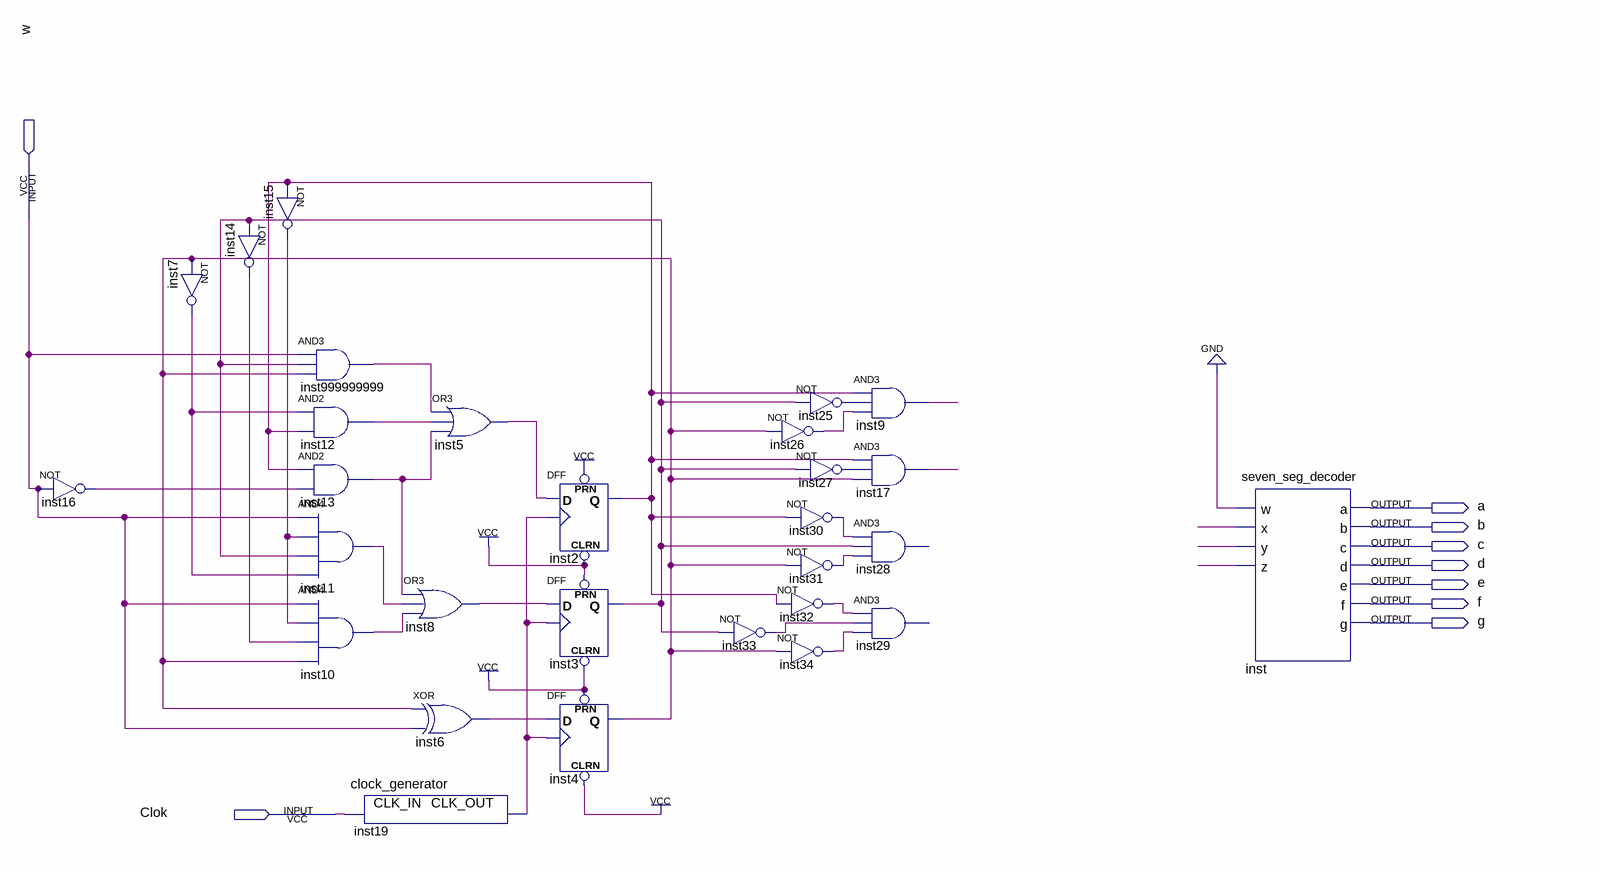
[diagram p0: schematic sheet]
// Quartus schematic lab11step1.bdf as structural Verilog: 29 symbols, 9 pins
module lab11step1 (
  input  w,
  input  Clok,
  output a,
  output b,
  output c,
  output d,
  output e,
  output f,
  output g
);

  wire inst2_q, inst3_q, inst4_q, inst5_out, inst6_out, inst7_out, inst8_out, inst9_out, inst10_out,
       inst11_out, inst12_out, inst13_out, inst14_out, inst15_out, inst16_out, inst17_out, inst19_clk_out,
       inst25_out, inst26_out, inst27_out, inst30_out, inst31_out, inst32_out, inst33_out, inst34_out,
       inst999999999_out, undriven, undriven_2, undriven_3;

  not inst16 (inst16_out, w);
  not inst7 (inst7_out, inst4_q);
  not inst15 (inst15_out, inst2_q);
  not inst14 (inst14_out, inst3_q);
  and inst999999999 (inst999999999_out, w, inst3_q, inst4_q);
  and inst12 (inst12_out, inst7_out, inst2_q);
  and inst13 (inst13_out, inst2_q, inst16_out);
  and inst11 (inst11_out, w, inst15_out, inst3_q, inst7_out);
  and inst10 (inst10_out, w, inst15_out, inst14_out, inst4_q);
  clock_generator inst19 (.CLK_IN(Clok), .CLK_OUT(inst19_clk_out));
  or inst5 (inst5_out, inst999999999_out, inst12_out, inst13_out);
  or inst8 (inst8_out, inst13_out, inst11_out, inst10_out);
  xor inst6 (inst6_out, inst4_q, w);
  DFF inst2 (.CLRN(1'b1), .CLK(inst19_clk_out), .D(inst5_out), .PRN(1'b1), .Q(inst2_q));
  DFF inst3 (.CLRN(1'b1), .CLK(inst19_clk_out), .D(inst8_out), .PRN(1'b1), .Q(inst3_q));
  DFF inst4 (.CLRN(1'b1), .CLK(inst19_clk_out), .D(inst6_out), .PRN(1'b1), .Q(inst4_q));
  not inst33 (inst33_out, inst3_q);
  not inst25 (inst25_out, inst3_q);
  not inst26 (inst26_out, inst4_q);
  not inst27 (inst27_out, inst3_q);
  not inst30 (inst30_out, inst2_q);
  not inst31 (inst31_out, inst4_q);
  not inst32 (inst32_out, inst2_q);
  not inst34 (inst34_out, inst4_q);
  and inst9 (inst9_out, inst2_q, inst25_out, inst26_out);
  and inst17 (inst17_out, inst2_q, inst27_out, inst4_q);
  // AND3 inst28 has open pins: IN1=inst30_out, IN2=inst3_q, IN3=inst31_out, OUT=open
  // AND3 inst29 has open pins: IN1=inst32_out, IN2=inst33_out, IN3=inst34_out, OUT=open
  seven_seg_decoder inst (
    .w(1'b0), .x(undriven_3), .y(undriven), .z(undriven_2), .a(a), .b(b), .c(c), .d(d), .e(e), .f(f), .g(g));
endmodule
